# Altium schematic sheet OZ440-SE100-CAR003_sheet9.SchDoc
size A3
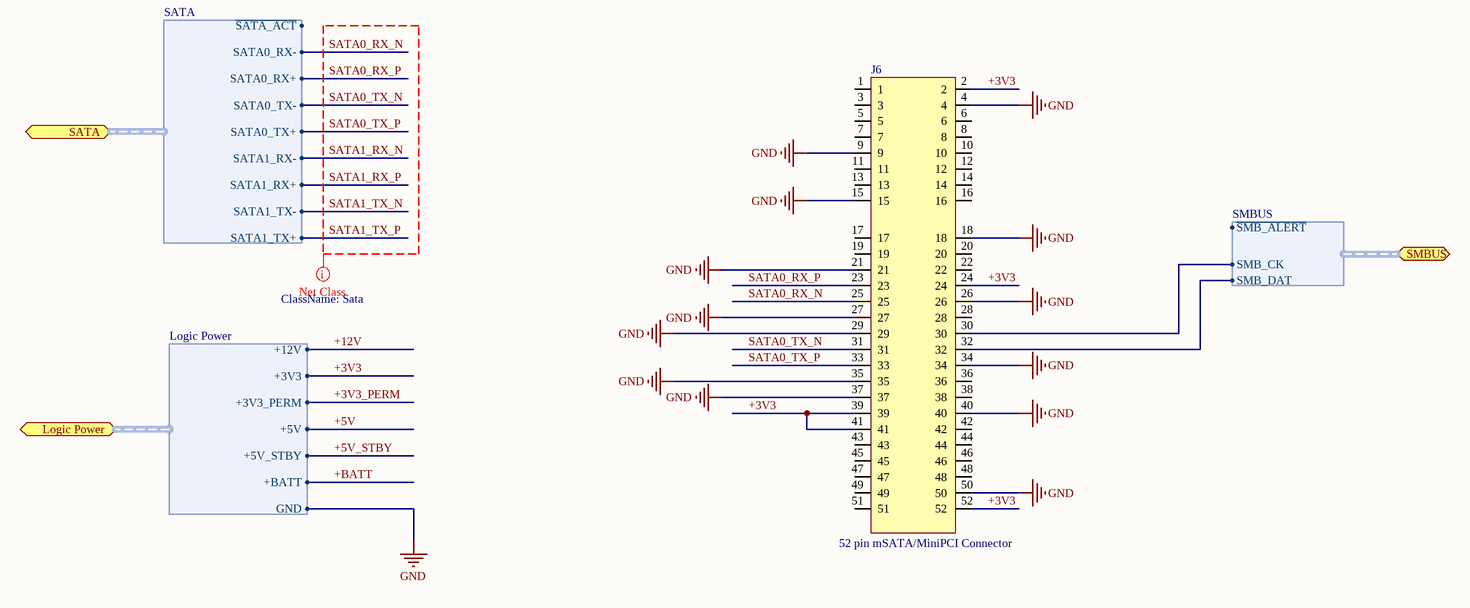
[diagram p0: OZ440-SE100-CAR003_sheet9.SchDoc]

## Parts
J6  Displayed reference: 52 pin mSATA/MiniPCI Connector  [CONN-SPE_MiniPCI-mSATA_MOLEX_67910-0002]  (hidden comment: CONN-STD-miniPCI_msata)

## Ports
Logic Power (harness Logic Power), SATA (harness SATA), SMBUS (harness SMBUS)

## Harnesses
SATA: ~{SATA_ACT}, SATA0_RX-, SATA0_RX+, SATA0_TX-, SATA0_TX+, SATA1_RX-, SATA1_RX+, SATA1_TX-, SATA1_TX+
Logic Power: +12V, +3V3, +3V3_PERM, +5V, +5V_STBY, +BATT, GND
SMBUS: ~{SMB_ALERT}, SMB_CK, SMB_DAT

## Nets
GND: J6.4 J6.9 J6.15 J6.18 J6.21 J6.26 J6.27 J6.29 J6.34 J6.35 J6.37 J6.40 J6.50 ; port Logic Power.GND
+3V3: J6.2 J6.24 J6.39 J6.41 J6.52 ; port Logic Power.+3V3
+3V3_PERM: port Logic Power.+3V3_PERM
+5V: port Logic Power.+5V
+5V_STBY: port Logic Power.+5V_STBY
+12V: port Logic Power.+12V
+BATT: port Logic Power.+BATT
SATA0_RX_N: J6.25 ; port SATA.SATA0_RX-
SATA0_RX_P: J6.23 ; port SATA.SATA0_RX+
SATA0_TX_N: J6.31 ; port SATA.SATA0_TX-
SATA0_TX_P: J6.33 ; port SATA.SATA0_TX+
SATA1_RX_N: port SATA.SATA1_RX-
SATA1_RX_P: port SATA.SATA1_RX+
SATA1_TX_N: port SATA.SATA1_TX-
SATA1_TX_P: port SATA.SATA1_TX+
NetJ6_30: J6.30 ; port SMBUS.SMB_CK
NetJ6_32: J6.32 ; port SMBUS.SMB_DAT

Not connected (* = marked no-connect by the designer): J6 1 3 5 6 7 8 10 11 12 13 14 16 17 19 20 22 28 36 38 42 43 44 45 46 47 48 49 51

## Layout directives
net class Sata: SATA0_RX_N, SATA0_RX_P, SATA0_TX_N, SATA0_TX_P, SATA1_RX_N, SATA1_RX_P, SATA1_TX_N, SATA1_TX_P

## Notes on the sheet
- Titre document:
- NAIO TECHNOLOGIES
- 3 Av didier Daurat
- 31400 TOULOUSE
- Auteur:
- Numéro document:
- Verificateur:
- Format:
- A3
- Date:
- Revision:
- Page:
- /

## Library data of the parts
J6 = 67910-0002: miniPCI / mSATA connector; Manufacturer: MOLEX; Validated: False; Reference: 67910-0002; Footprint description: 52 pin SMD, 0.8mm pitch; Pin Count: 52; Rev: C; helpURL: http://www.farnell.com/datasheets/70912.pdf; Supplier 1: Farnell; Supplier Part Number 1: 1394481; Supplier 2: Mouser; Supplier Part Number 2: 538-67910-0002